# Altium schematic sheet Sheet2_old.SchDoc
size A3
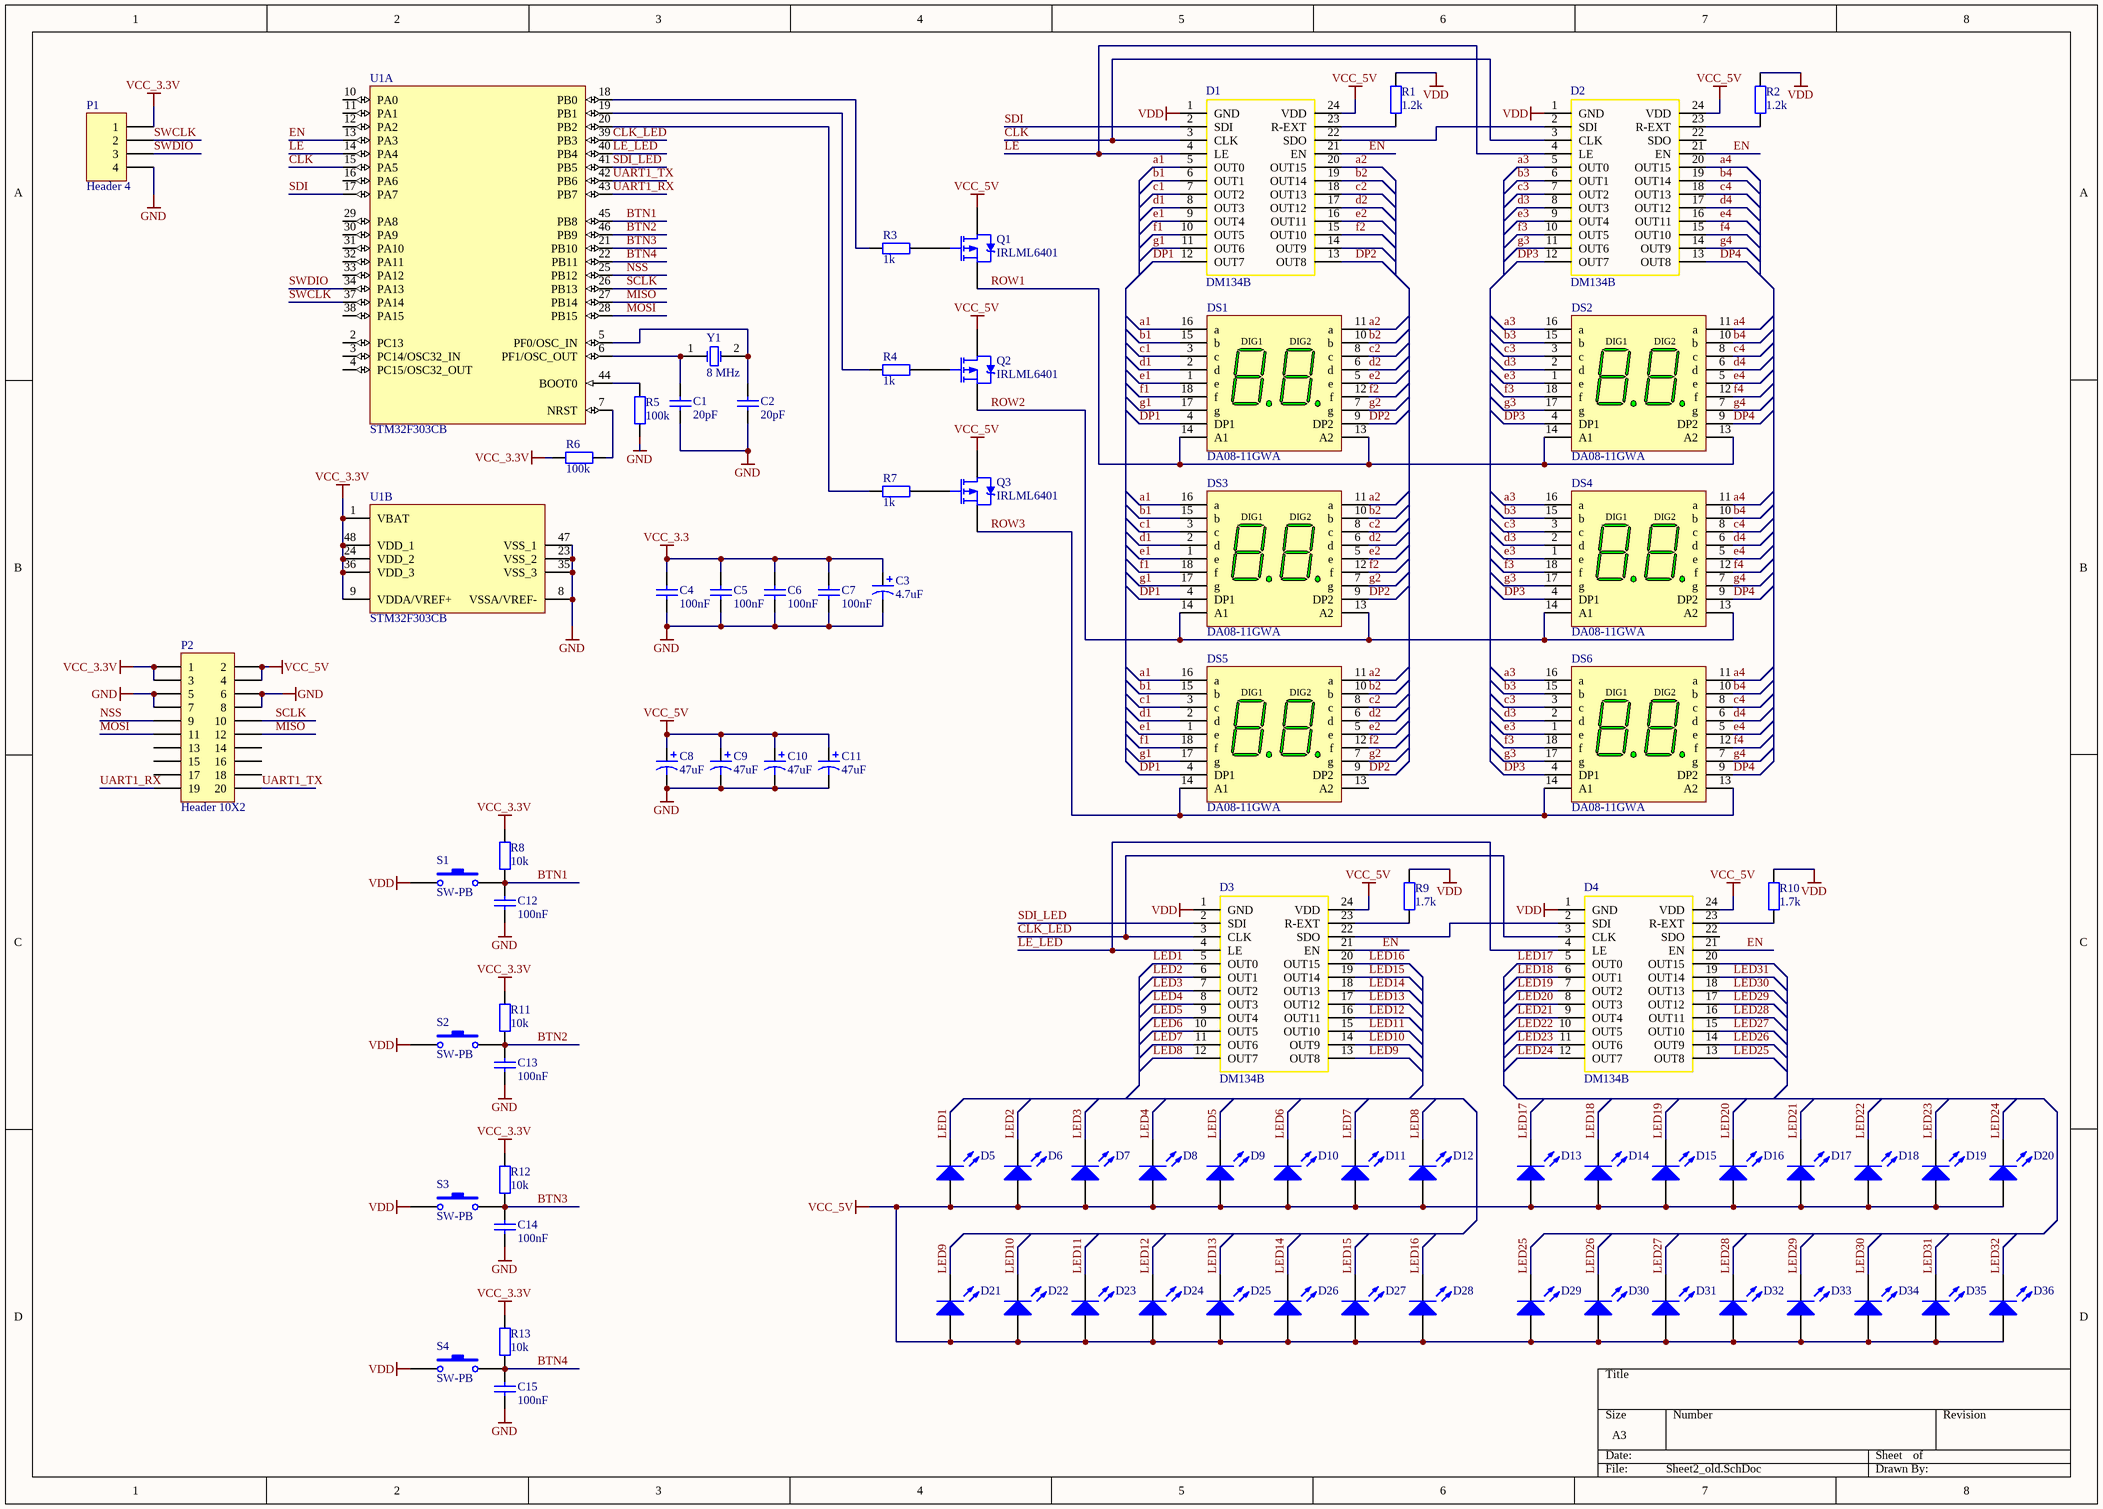
[diagram p0: Sheet2_old.SchDoc]

## Parts
C1  20pF  [RAD-0.3]
C2  20pF  [RAD-0.3]
C3  4.7uF  [RB7.6-15]
C4  100nF  [RAD-0.3]
C5  100nF  [RAD-0.3]
C6  100nF  [RAD-0.3]
C7  100nF  [RAD-0.3]
C8  47uF  [RB7.6-15]
C9  47uF  [RB7.6-15]
C10  47uF  [RB7.6-15]
C11  47uF  [RB7.6-15]
C12  100nF  [RAD-0.3]
C13  100nF  [RAD-0.3]
C14  100nF  [RAD-0.3]
C15  100nF  [RAD-0.3]
D1  DM134B
D2  DM134B
D3  DM134B
D4  DM134B
D5  LED0  [LED-0]  (value not drawn)
D6  LED0  [LED-0]  (value not drawn)
D7  LED0  [LED-0]  (value not drawn)
D8  LED0  [LED-0]  (value not drawn)
D9  LED0  [LED-0]  (value not drawn)
D10  LED0  [LED-0]  (value not drawn)
D11  LED0  [LED-0]  (value not drawn)
D12  LED0  [LED-0]  (value not drawn)
D13  LED0  [LED-0]  (value not drawn)
D14  LED0  [LED-0]  (value not drawn)
D15  LED0  [LED-0]  (value not drawn)
D16  LED0  [LED-0]  (value not drawn)
D17  LED0  [LED-0]  (value not drawn)
D18  LED0  [LED-0]  (value not drawn)
D19  LED0  [LED-0]  (value not drawn)
D20  LED0  [LED-0]  (value not drawn)
D21  LED0  [LED-0]  (value not drawn)
D22  LED0  [LED-0]  (value not drawn)
D23  LED0  [LED-0]  (value not drawn)
D24  LED0  [LED-0]  (value not drawn)
D25  LED0  [LED-0]  (value not drawn)
D26  LED0  [LED-0]  (value not drawn)
D27  LED0  [LED-0]  (value not drawn)
D28  LED0  [LED-0]  (value not drawn)
D29  LED0  [LED-0]  (value not drawn)
D30  LED0  [LED-0]  (value not drawn)
D31  LED0  [LED-0]  (value not drawn)
D32  LED0  [LED-0]  (value not drawn)
D33  LED0  [LED-0]  (value not drawn)
D34  LED0  [LED-0]  (value not drawn)
D35  LED0  [LED-0]  (value not drawn)
D36  LED0  [LED-0]  (value not drawn)
DS1  DA08-11GWA
DS2  DA08-11GWA
DS3  DA08-11GWA
DS4  DA08-11GWA
DS5  DA08-11GWA
DS6  DA08-11GWA
P1  Header 4  [HDR1X4]
P2  Header 10X2  [HDR2X10]
Q1  IRLML6401  [TO-220AB]
Q2  IRLML6401  [TO-220AB]
Q3  IRLML6401  [TO-220AB]
R1  1.2k  [AXIAL-0.4]
R2  1.2k  [AXIAL-0.4]
R3  1k  [AXIAL-0.4]
R4  1k  [AXIAL-0.4]
R5  100k  [AXIAL-0.4]
R6  100k  [AXIAL-0.4]
R7  1k  [AXIAL-0.4]
R8  10k  [AXIAL-0.4]
R9  1.7k  [AXIAL-0.4]
R10  1.7k  [AXIAL-0.4]
R11  10k  [AXIAL-0.4]
R12  10k  [AXIAL-0.4]
R13  10k  [AXIAL-0.4]
S1  SW-PB  [SPST-2]
S2  SW-PB  [SPST-2]
S3  SW-PB  [SPST-2]
S4  SW-PB  [SPST-2]
U1  STM32F303CB  [LQFP48_M]  (parts A,B of 2)
Y1  8 MHz  [R38]

## Nets
GND: C1.1 C2.1 C3.2 C4.1 C5.1 C6.1 C7.1 C8.2 C9.2 C10.2 C11.2 C12.1 C13.1 C14.1 C15.1 P1.4 P2.5 P2.6 P2.7 P2.8 R5.1 U1.8(VSSA/VREF-) U1.23(VSS_2) U1.35(VSS_3) U1.47(VSS_1)
VCC_3.3: C3.1 C4.2 C5.2 C6.2 C7.2
VCC_3.3V: P1.1 P2.1 P2.3 R6.1 R8.1 R11.1 R12.1 R13.1 U1.1(VBAT) U1.9(VDDA/VREF+) U1.24(VDD_2) U1.36(VDD_3) U1.48(VDD_1)
VCC_5V: C8.1 C9.1 C10.1 C11.1 D1.24(VDD) D2.24(VDD) D3.24(VDD) D4.24(VDD) D5.1(A) D6.1(A) D7.1(A) D8.1(A) D9.1(A) D10.1(A) D11.1(A) D12.1(A) D13.1(A) D14.1(A) D15.1(A) D16.1(A) D17.1(A) D18.1(A) D19.1(A) D20.1(A) D21.1(A) D22.1(A) D23.1(A) D24.1(A) D25.1(A) D26.1(A) D27.1(A) D28.1(A) D29.1(A) D30.1(A) D31.1(A) D32.1(A) D33.1(A) D34.1(A) D35.1(A) D36.1(A) P2.2 P2.4 Q1.2(D) Q2.2(D) Q3.2(D)
VDD: D1.1(GND) D2.1(GND) D3.1(GND) D4.1(GND) R1.1 R2.1 R9.1 R10.1 S1.2 S2.2 S3.2 S4.2
a1: D1.5(OUT0) DS1.16(a) DS3.16(a) DS5.16(a)
a2: D1.20(OUT15) DS1.11(a) DS3.11(a) DS5.11(a)
a3: D2.5(OUT0) DS2.16(a) DS4.16(a) DS6.16(a)
a4: D2.20(OUT15) DS2.11(a) DS4.11(a) DS6.11(a)
b1: D1.6(OUT1) DS1.15(b) DS3.15(b) DS5.15(b)
b2: D1.19(OUT14) DS1.10(b) DS3.10(b) DS5.10(b)
b3: D2.6(OUT1) DS2.15(b) DS4.15(b) DS6.15(b)
b4: D2.19(OUT14) DS2.10(b) DS4.10(b) DS6.10(b)
BTN1: C12.2 R8.2 S1.1 U1.45(PB8)
BTN2: C13.2 R11.2 S2.1 U1.46(PB9)
BTN3: C14.2 R12.2 S3.1 U1.21(PB10)
BTN4: C15.2 R13.2 S4.1 U1.22(PB11)
c1: D1.7(OUT2) DS1.3(c) DS3.3(c) DS5.3(c)
c2: D1.18(OUT13) DS1.8(c) DS3.8(c) DS5.8(c)
c3: D2.7(OUT2) DS2.3(c) DS4.3(c) DS6.3(c)
c4: D2.18(OUT13) DS2.8(c) DS4.8(c) DS6.8(c)
CLK: D1.3(CLK) D2.3(CLK) U1.15(PA5)
CLK_LED: D3.3(CLK) D4.3(CLK) U1.39(PB3)
d1: D1.8(OUT3) DS1.2(d) DS3.2(d) DS5.2(d)
d2: D1.17(OUT12) DS1.6(d) DS3.6(d) DS5.6(d)
d3: D2.8(OUT3) DS2.2(d) DS4.2(d) DS6.2(d)
d4: D2.17(OUT12) DS2.6(d) DS4.6(d) DS6.6(d)
DP1: D1.12(OUT7) DS1.4(DP1) DS3.4(DP1) DS5.4(DP1)
DP2: D1.13(OUT8) DS1.9(DP2) DS3.9(DP2) DS5.9(DP2)
DP3: D2.12(OUT7) DS2.4(DP1) DS4.4(DP1) DS6.4(DP1)
DP4: D2.13(OUT8) DS2.9(DP2) DS4.9(DP2) DS6.9(DP2)
e1: D1.9(OUT4) DS1.1(e) DS3.1(e) DS5.1(e)
e2: D1.16(OUT11) DS1.5(e) DS3.5(e) DS5.5(e)
e3: D2.9(OUT4) DS2.1(e) DS4.1(e) DS6.1(e)
e4: D2.16(OUT11) DS2.5(e) DS4.5(e) DS6.5(e)
EN: D1.21(EN) D2.21(EN) D3.21(EN) D4.21(EN) U1.13(PA3)
f1: D1.10(OUT5) DS1.18(f) DS3.18(f) DS5.18(f)
f2: D1.15(OUT10) DS1.12(f) DS3.12(f) DS5.12(f)
f3: D2.10(OUT5) DS2.18(f) DS4.18(f) DS6.18(f)
f4: D2.15(OUT10) DS2.12(f) DS4.12(f) DS6.12(f)
g1: D1.11(OUT6) DS1.17(g) DS3.17(g) DS5.17(g)
g2: DS1.7(g) DS3.7(g) DS5.7(g)
g3: D2.11(OUT6) DS2.17(g) DS4.17(g) DS6.17(g)
g4: D2.14(OUT9) DS2.7(g) DS4.7(g) DS6.7(g)
LE: D1.4(LE) D2.4(LE) U1.14(PA4)
LE_LED: D3.4(LE) D4.4(LE) U1.40(PB4)
LED1: D3.5(OUT0) D5.2(K)
LED2: D3.6(OUT1) D6.2(K)
LED3: D3.7(OUT2) D7.2(K)
LED4: D3.8(OUT3) D8.2(K)
LED5: D3.9(OUT4) D9.2(K)
LED6: D3.10(OUT5) D10.2(K)
LED7: D3.11(OUT6) D11.2(K)
LED8: D3.12(OUT7) D12.2(K)
LED9: D3.13(OUT8) D21.2(K)
LED10: D3.14(OUT9) D22.2(K)
LED11: D3.15(OUT10) D23.2(K)
LED12: D3.16(OUT11) D24.2(K)
LED13: D3.17(OUT12) D25.2(K)
LED14: D3.18(OUT13) D26.2(K)
LED15: D3.19(OUT14) D27.2(K)
LED16: D3.20(OUT15) D28.2(K)
LED17: D4.5(OUT0) D13.2(K)
LED18: D4.6(OUT1) D14.2(K)
LED19: D4.7(OUT2) D15.2(K)
LED20: D4.8(OUT3) D16.2(K)
LED21: D4.9(OUT4) D17.2(K)
LED22: D4.10(OUT5) D18.2(K)
LED23: D4.11(OUT6) D19.2(K)
LED24: D4.12(OUT7) D20.2(K)
LED25: D4.13(OUT8) D29.2(K)
LED26: D4.14(OUT9) D30.2(K)
LED27: D4.15(OUT10) D31.2(K)
LED28: D4.16(OUT11) D32.2(K)
LED29: D4.17(OUT12) D33.2(K)
LED30: D4.18(OUT13) D34.2(K)
LED31: D4.19(OUT14) D35.2(K)
LED32: D36.2(K)
MISO: P2.12 U1.27(PB14)
MOSI: P2.11 U1.28(PB15)
NSS: P2.9 U1.25(PB12)
ROW1: DS1.13(A2) DS1.14(A1) DS2.13(A2) DS2.14(A1) Q1.3(S)
ROW2: DS3.13(A2) DS3.14(A1) DS4.13(A2) DS4.14(A1) Q2.3(S)
ROW3: DS5.14(A1) DS6.13(A2) DS6.14(A1) Q3.3(S)
SCLK: P2.10 U1.26(PB13)
SDI: D1.2(SDI) U1.17(PA7)
SDI_LED: D3.2(SDI) U1.41(PB5)
SWCLK: P1.2 U1.37(PA14)
SWDIO: P1.3 U1.34(PA13)
UART1_RX: P2.19 U1.43(PB7)
UART1_TX: P2.20 U1.42(PB6)
NetC1_2: C1.2 U1.6(PF1/OSC_OUT) Y1.1(OSC1)
NetC2_2: C2.2 U1.5(PF0/OSC_IN) Y1.2(OSC2)
NetD1_22: D1.22(SDO) D2.2(SDI)
NetD1_23: D1.23(R-EXT) R1.2
NetD2_23: D2.23(R-EXT) R2.2
NetD3_22: D3.22(SDO) D4.2(SDI)
NetD3_23: D3.23(R-EXT) R9.2
NetD4_23: D4.23(R-EXT) R10.2
NetQ1_1: Q1.1(G) R3.2
NetQ2_1: Q2.1(G) R4.2
NetQ3_1: Q3.1(G) R7.2
NetR3_1: R3.1 U1.18(PB0)
NetR4_1: R4.1 U1.19(PB1)
NetR5_2: R5.2 U1.44(BOOT0)
NetR6_2: R6.2 U1.7(NRST)
NetR7_1: R7.1 U1.20(PB2)

Not connected (* = marked no-connect by the designer): D1 14(OUT9); D2 22(SDO); D4 20(OUT15) 22(SDO); DS5 13(A2); P2 13 14 15 16 17 18; U1 2(PC13) 3(PC14/OSC32_IN) 4(PC15/OSC32_OUT) 10(PA0) 11(PA1) 12(PA2) 16(PA6) 29(PA8) 30(PA9) 31(PA10) 32(PA11) 33(PA12) 38(PA15)

## Notes on the sheet
- (in symbol DA08-11GWA) DIG1; DIG2

## Library data of the parts
C1 C2 = Cap: Capacitor; Value: 100pF; Published: 8-Jun-2000; LatestRevisionDate: 17-Jul-2002; LatestRevisionNote: Re-released for DXP Platform.; PackageReference: RAD-0.3; Publisher: Altium Limited; PackageDescription: Radial Cap, Thru-Hole; 2 Leads; 0.3 in Pin Spacing
C3 C8-C11 = Cap Pol1: Polarized Capacitor (Radial); Value: 10uF; Published: 8-Jun-2000; LatestRevisionDate: 17-Jul-2002; LatestRevisionNote: Re-released for DXP Platform.; PackageReference: RB7.6-15; Publisher: Altium Limited; PackageDescription: Polarized Capacitor (Radial); 2 Leads
C4-C7 C12-C15 = Cap: Capacitor; Value: 0.1uF; Published: 8-Jun-2000; LatestRevisionDate: 17-Jul-2002; LatestRevisionNote: Re-released for DXP Platform.; PackageReference: RAD-0.3; Publisher: Altium Limited; PackageDescription: Radial Cap, Thru-Hole; 2 Leads; 0.3 in Pin Spacing
D1-D4 = DM134B: LED Driver; Type: LED Driver
D5-D36 = LED0: Typical INFRARED GaAs LED; Published: 8-Jun-2000; LatestRevisionDate: 08-Jul-2005; LatestRevisionNote: Mech Layer 1 removed.; PackageReference: LED-0; Publisher: Altium Limited; PackageDescription: LED; 2 Leads
DS1-DS6 = DA08-11GWA: Двухсимвольный светодиодный индикатор
P1 = Header 4: Header, 4-Pin; LatestRevisionDate: 17-Jul-2002; LatestRevisionNote: Re-released for DXP Platform.; Publisher: Altium Limited
P2 = Header 10X2: Header, 10-Pin, Dual row; LatestRevisionDate: 17-Jul-2002; LatestRevisionNote: Re-released for DXP Platform.; Publisher: Altium Limited
Q1-Q3 = PMOS-2: P-Channel Power MOSFET; Note: Pin 4 not drawn and electrically connected to Pin 2.; Published: 8-Jun-2000; LatestRevisionDate: 17-Jul-2002; LatestRevisionNote: Re-released for DXP Platform.; DatasheetVersion: PD-9.390D; PackageVersion: Feb-1997; PackageReference: TO-220AB; Publisher: Altium Limited; PackageDescription: TO, Thru-Hole, Vertical, Heatsink Mounted; 3 In-Line Leads; Pitch 2.54 mm; ComponentLink1Description: Manufacturer Link; ComponentLink1URL: http://www.irf.com/
R1 R2 R9 R10 = Res2: Resistor; Value: 4K7; Published: 8-Jun-2000; LatestRevisionDate: 17-Jul-2002; LatestRevisionNote: Re-released for DXP Platform.; PackageReference: AXIAL-0.4; Publisher: Altium Limited; PackageDescription: Axial Device, Thru-Hole; 2 Leads; 0.4 in Pin Spacing
R3 R4 R7 R8 R11-R13 = Res2: Resistor; Published: 8-Jun-2000; LatestRevisionDate: 17-Jul-2002; LatestRevisionNote: Re-released for DXP Platform.; PackageReference: AXIAL-0.4; Publisher: Altium Limited; PackageDescription: Axial Device, Thru-Hole; 2 Leads; 0.4 in Pin Spacing
  R3 R4 R7: Value: 1K
  R8 R11-R13: Value: 10K
R5 R6 = Res2: Resistor; Value: 1K; Published: 8-Jun-2000; LatestRevisionDate: 17-Jul-2002; LatestRevisionNote: Re-released for DXP Platform.; PackageReference: AXIAL-0.4; Publisher: Altium Limited; PackageDescription: Axial Device, Thru-Hole; 2 Leads; 0.4 in Pin Spacing
S1-S4 = SW-PB: Switch; Published: 24-Mar-1999; LatestRevisionDate: 17-Jul-2002; LatestRevisionNote: Re-released for DXP Platform.; PackageReference: SPST-2; Publisher: Altium Limited; PackageDescription: Switch; 2 Leads
U1 = STM32F303CB: STM32 ARM-based 32-bit MCU Value Line with 16 kB Flash, 4 kB Internal RAM, Internal Code B, -40 to +85°C Temperature, 48-Pin LQFP, Tray; DatasheetVersion: rev6.0, Apr-2011; PackageVersion: rev13, Apr-2011; PackageReference: LQFP48; PackageDescription: 48-Pin Low-Profile Quad Flat Pack, 7 x 7 mm Body, 0.5 mm Pitch (LQFP48); ComponentLink1Description: Manufacturer URL; ComponentLink1URL: http://www.st.com/; ComponentLink2Description: STM32F303 Datasheet; ComponentLink2URL: http://www.st.com/st-web-ui/static/active/en/resource/technical/document/datasheet/DM00058181.pdf; ComponentLink3Description: STM32 Family Web Page; ComponentLink3URL: www.st.com/stm32
Y1 = XTAL: Crystal Oscillator; Published: 8-Jun-2000; LatestRevisionDate: 17-Jul-2002; LatestRevisionNote: Re-released for DXP Platform.; PackageReference: R38; Publisher: Altium Limited; PackageDescription: Crystal, Thru-Hole; 2 Leads; Body 3.1 x 8.2 mm (Dia.xH)